# EasyEDA Pro project ProPrj_smartmower_2025-07-31_08-52-16_2025-10-22.epro, board PCB2
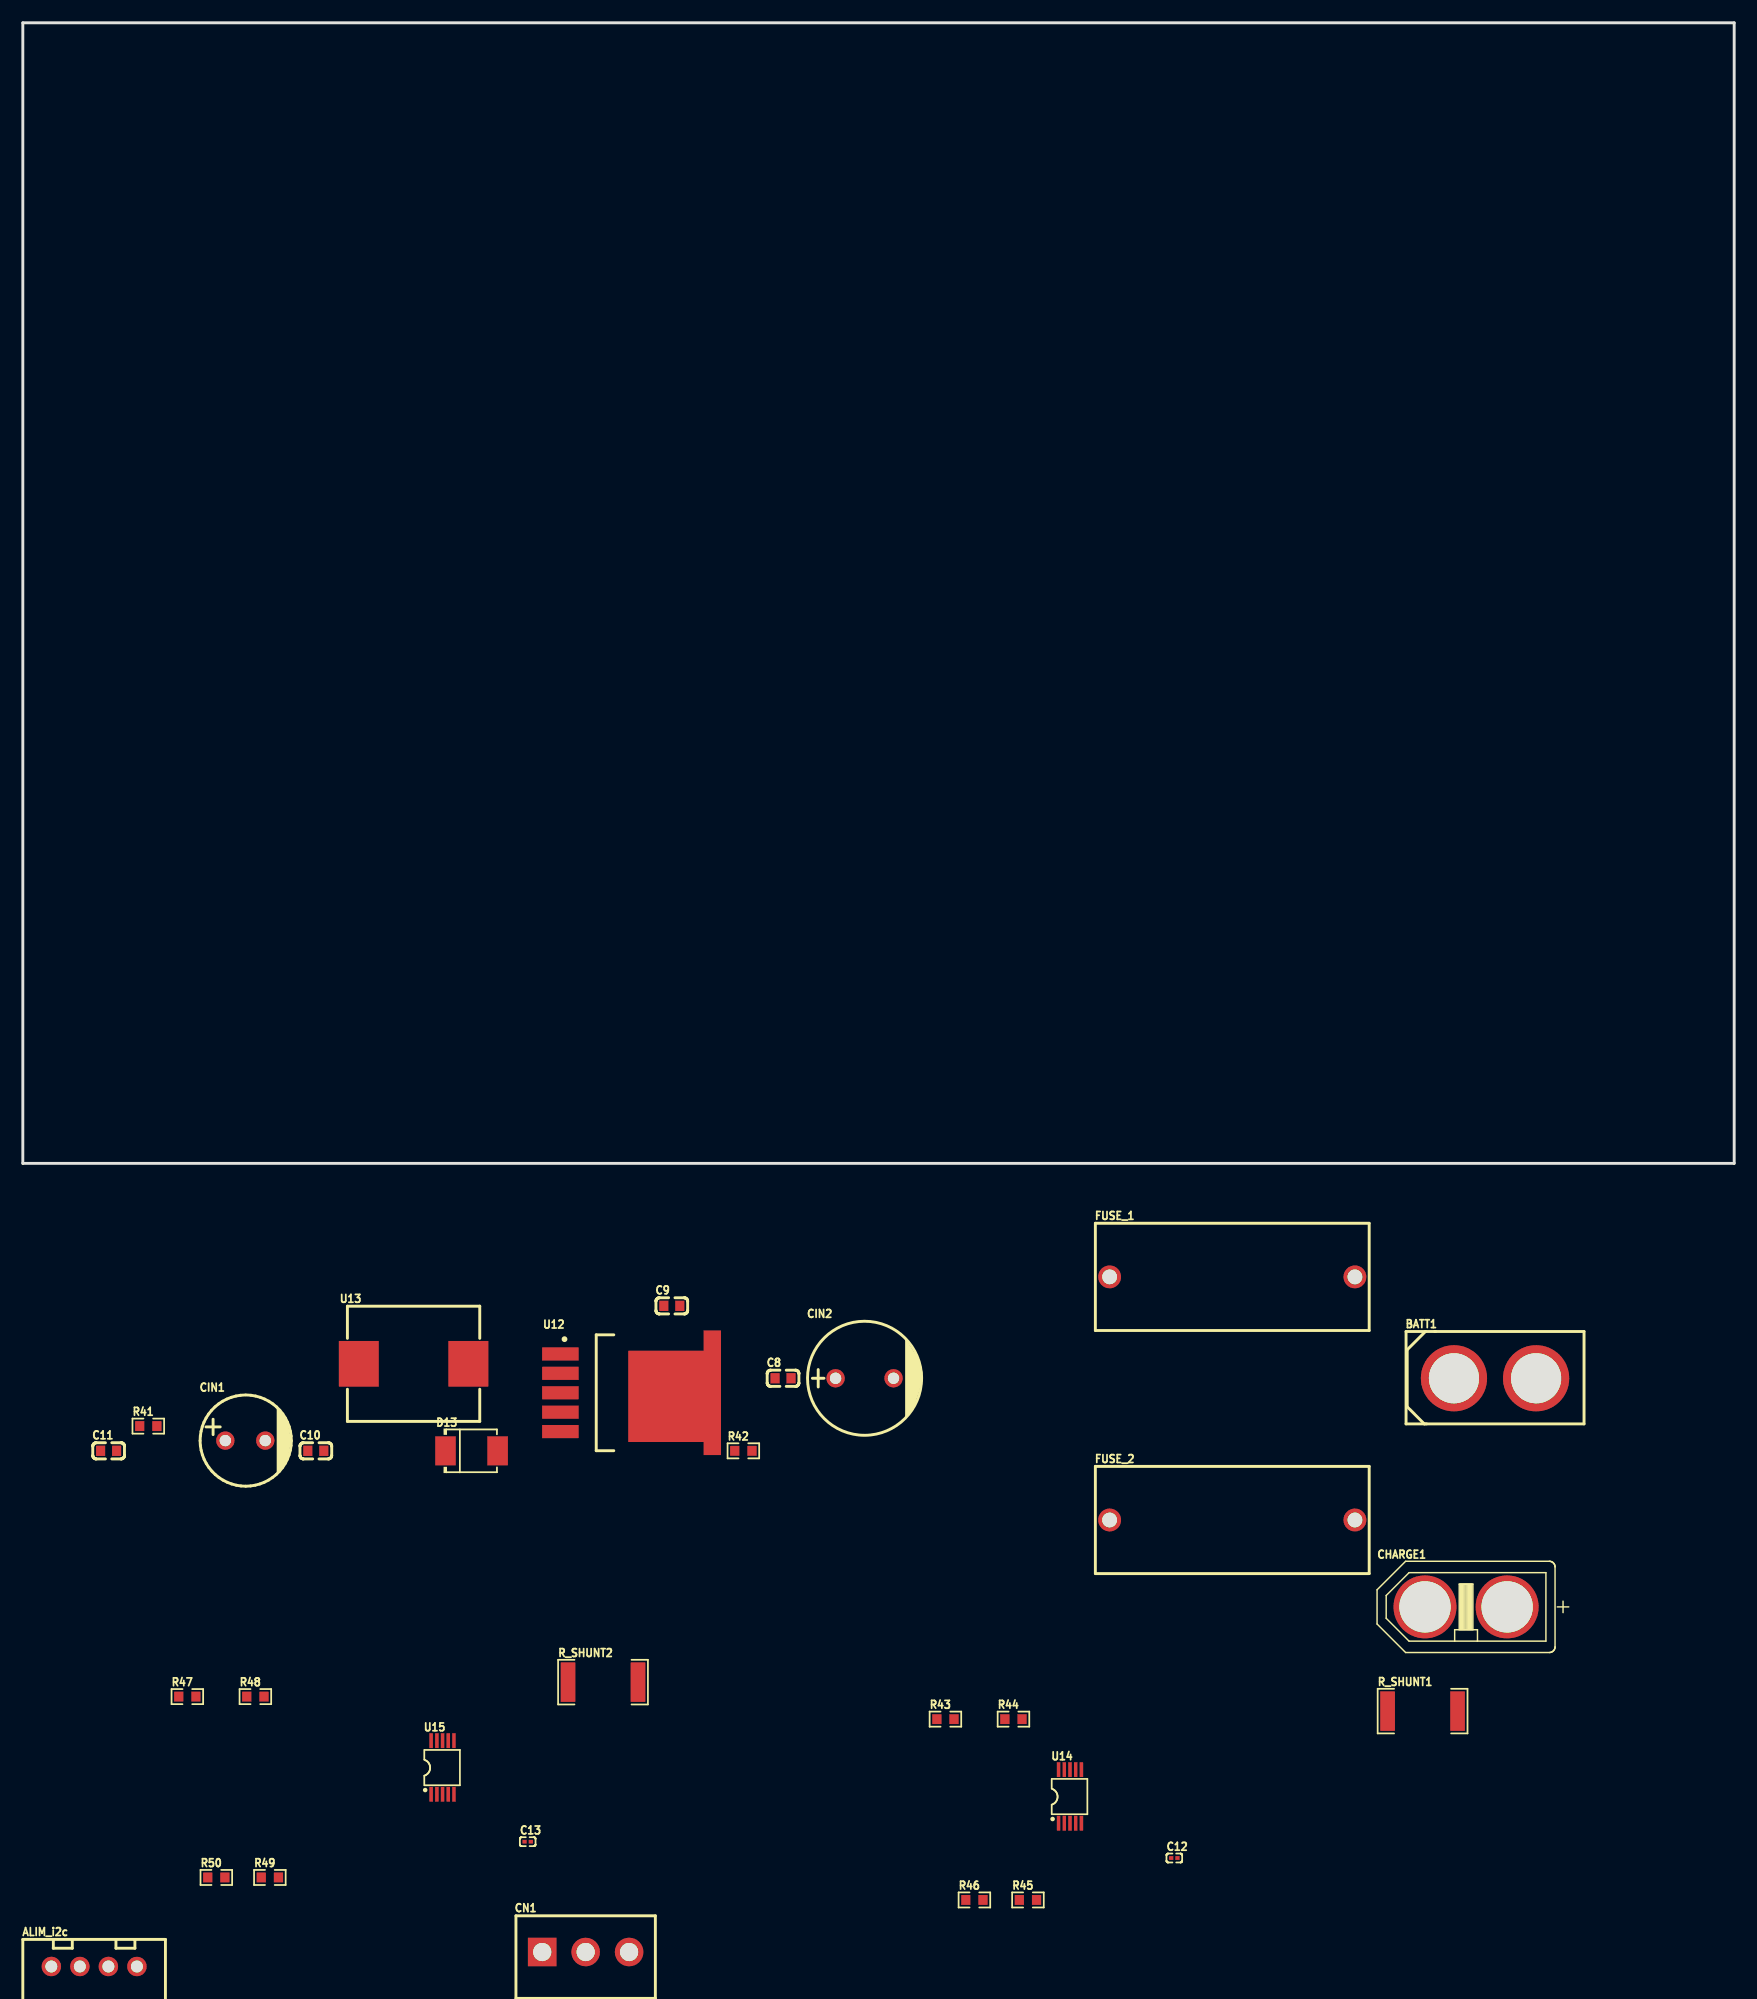
[diagram p2: board, top side]
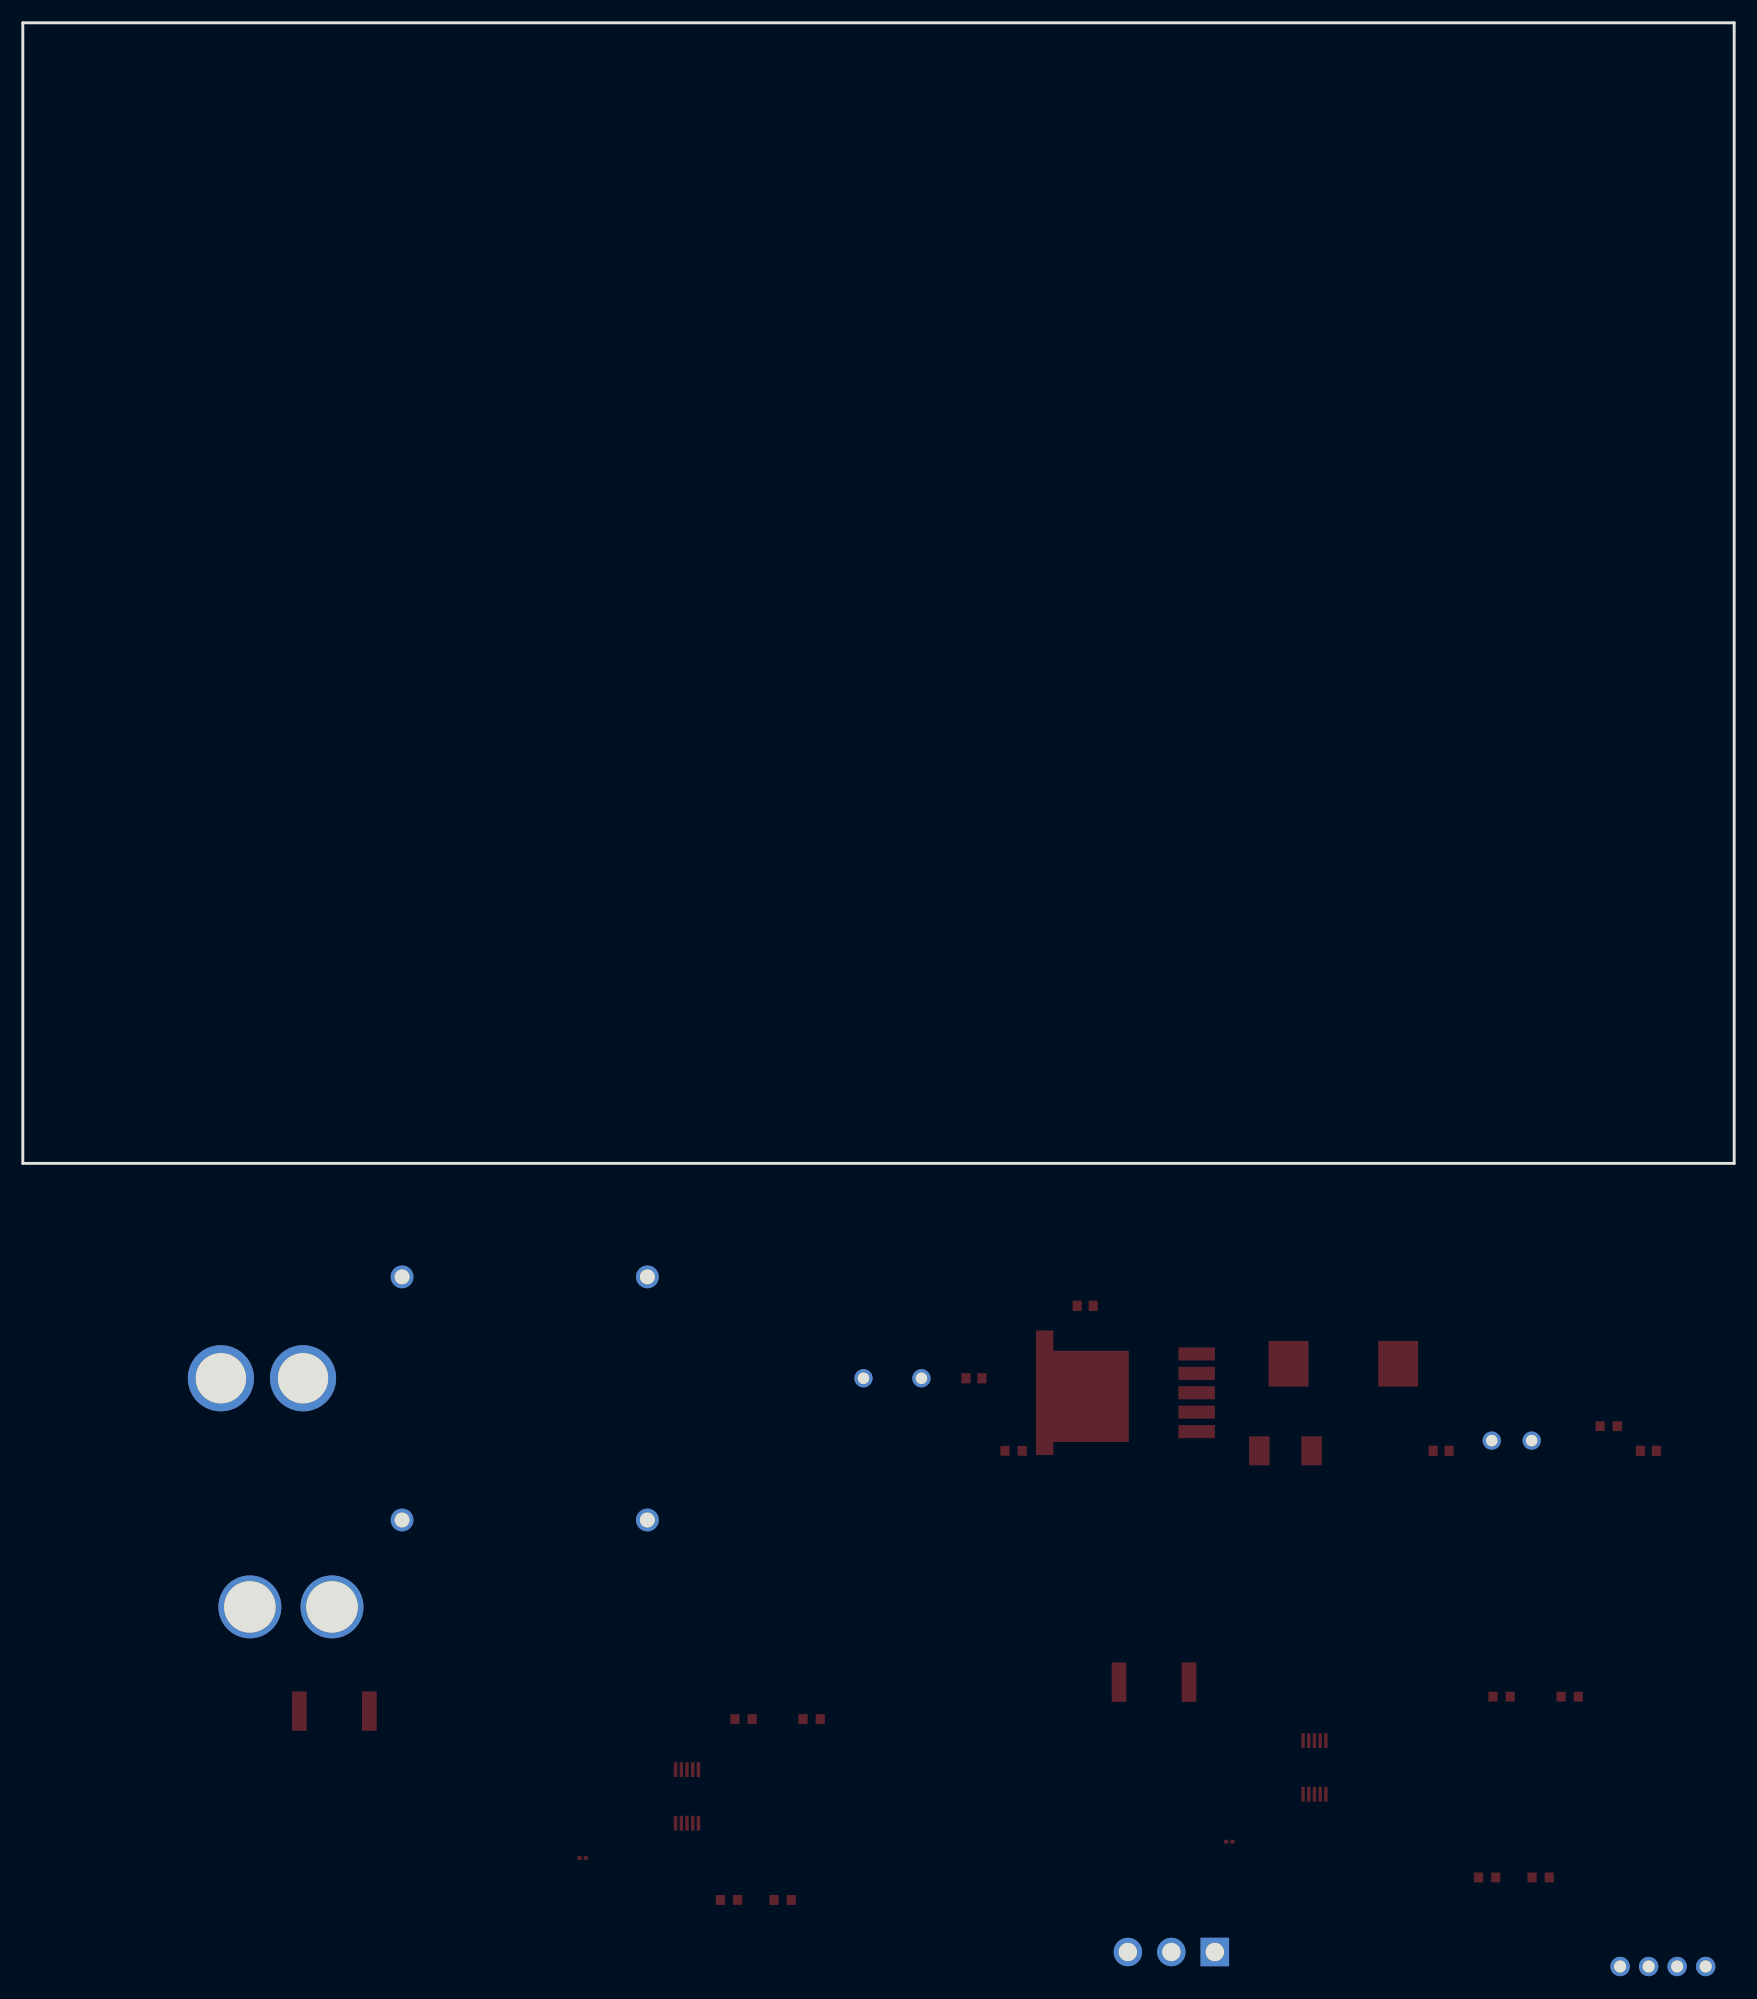
[diagram p3: board, bottom side, seen from below]

Outline 150 x 100 mm; copper layers: Top Layer, Bottom Layer. Coordinates in mm from the lower left corner of the outline.
Outline path: 0,100 150,100 150,0 0,0 0,100
Stack: Top Layer 0.035mm / Dielectric1 1.51mm FR4 er 4.5 / Bottom Layer 0.035mm

## Design rules (mm)
template: JLCPCB Capability(Two Layers Board)
spacing copperThickness1oz (default): track to track 0.102, other pairs 0.152 to 0.3
spacing copperThickness2oz: track to track 0.203, other pairs 0.152 to 0.3
track width copperThickness1oz (default): min 0.127, default 0.254, max 2.54
track width copperThickness2oz: min 0.203, default 0.254, max 2.54
differential pair differentialPair (default): width min 0.127, default 0.254, max 2.54; gap min 0.152, default 0.152
via viaSize (default): diameter min 0.5, default 0.61, max 10; hole min 0.3, default 0.305, max 6.3

## Placement (name value [footprint] x y rotation side)
ALIM_i2c  i2c  [CONN-TH_4P-P2.50-XH2.54-4P]  6.25 -70.42 0 top
BATT1  Batteria  [CONN-TH_XT60]  129.04 -18.84 0 top
C8  100nF  [C0603]  66.63 -18.84 0 top
C9  100nF  [C0603]  56.88 -12.49 0 top
C10  100nF  [C0603]  25.68 -25.21 0 top
C11  33nF  [C0603]  7.52 -25.21 0 top
C12  100nF  [C0201]  100.93 -60.91 0 top
C13  100nF  [C0201]  44.25 -59.47 0 top
CHARGE1  Carica Batteria  [CONN-TH_XT60PB-F]  126.5 -38.89 0 top
CIN1  330uF  [CAP-TH_BD8.0-P3.50-D0.6-FD]  19.5 -24.31 0 top
CIN2  220uF  [CAP-TH_BD10.0-P5.00-D1.0-FD]  73.78 -18.84 0 top
CN1  DB2EVC-3.81-3P-GN  [CONN-TH_3P-P3.81_DB2EVC-3.81-3P]  49.33 -69.15 0 top
D13  SS54  [SMBF_L4.3-W3.6-LS5.3-RD]  39.33 -25.21 0 top
FUSE_1  XF-001  [CONN-TH_XF-001]  106.01 -9.95 0 top
FUSE_2  XF-001  [CONN-TH_XF-001]  106.01 -31.27 0 top
R41  10K  [R0603]  11 -23.04 0 top
R42  3.3K  [R0603]  63.16 -25.21 0 top
R43  10kΩ  [R0603]  80.87 -48.73 0 top
R44  10kΩ  [R0603]  86.83 -48.73 0 top
R45  10kΩ  [R0603]  88.1 -64.58 0 top
R46  10kΩ  [R0603]  83.41 -64.58 0 top
R47  10kΩ  [R0603]  14.42 -46.76 0 top
R48  10kΩ  [R0603]  20.38 -46.76 0 top
R49  10kΩ  [R0603]  21.65 -62.61 0 top
R50  10kΩ  [R0603]  16.96 -62.61 0 top
R_SHUNT1  10mΩ  [R2512]  122.69 -48.03 0 top
R_SHUNT2  10mΩ  [R2512]  50.85 -45.49 0 top
U12  XL4015E1  [TO-263-5_L10.2-W8.9-P1.70-TL]  52.12 -20.11 0 top
U13  47uH  [IND-SMD_L11.6-W10.1]  34.25 -17.57 0 top
U14  INA226AQDGSRQ1  [VSSOP-10_L3.0-W3.0-P0.50-LS4.9-BL]  91.78 -55.51 0 top
U15  INA226AQDGSRQ1  [VSSOP-10_L3.0-W3.0-P0.50-LS4.9-BL]  36.79 -52.97 0 top

## Footprints (pads in the part's own frame, mm; a bottom-side part is the same pattern mirrored in y, then rotated)
C0201
  rect 0.368x0.324 smd: 1(-0.275,0) 2(0.275,0)
C0603
  rect 0.8x0.9 smd: 1(-0.7,0) 2(0.7,0)
CAP-TH_BD8.0-P3.50-D0.6-FD
  round 1.6 hole 1: 1(-1.75,0) 2(1.75,0)
CAP-TH_BD10.0-P5.00-D1.0-FD
  round 1.6 hole 1: 1(-2.54,0) 2(2.54,0)
CONN-TH_3P-P3.81_DB2EVC-3.81-3P
  rect 2.5x2.5 hole 1.6: 1(-3.81,0)
  round 2.5 hole 1.6: 2(0,0) 3(3.81,0)
CONN-TH_4P-P2.50-XH2.54-4P
  round 1.7 hole 1.05: 1(3.75,0) 2(1.25,0) 3(-1.25,0) 4(-3.75,0)
CONN-TH_XF-001
  round 2 hole 1.3: 1(-10.75,0) 2(10.75,0)
CONN-TH_XT60
  round 5.8 hole 4.4: 1(-3.6,0) 2(3.6,0)
CONN-TH_XT60PB-F
  round 5.516 hole 4.505x4.5: +(3.6,0) -(-3.6,0)
IND-SMD_L11.6-W10.1
  rect 3.5x4 smd: 1(-4.8,0) 2(4.8,0)
R0603
  rect 0.806x0.864 smd: 1(-0.753,0) 2(0.753,0)
R2512
  rect 1.282x3.456 smd: 1(-3.067,0) 2(3.067,0)
SMBF_L4.3-W3.6-LS5.3-RD
  rect 1.8x2.54 smd: 1(-2.285,0) 2(2.285,0)
TO-263-5_L10.2-W8.9-P1.70-TL
  rect 3.2x1.15 smd: 1(-5.008,3.404) 2(-5.008,1.702) 3(-5.008,0) 4(-5.008,-1.702) 5(-5.008,-3.404)
  custom 8.128x10.922 smd: 6(5.008,-0.318)
VSSOP-10_L3.0-W3.0-P0.50-LS4.9-BL
  rect 0.3x1.3 smd: 1(-1,-2.35) 2(-0.5,-2.35) 3(0,-2.35) 4(0.5,-2.35) 5(1,-2.35) 6(1,2.35) 7(0.5,2.35) 8(0,2.35) 9(-0.5,2.35) 10(-1,2.35)

## Nets
As in the schematic, except:
5V_ALI: C10.2 C11.2 CIN1.1 CN1.3 R41.2 U13.1
GND_ALI: ALIM_i2c.3 BATT1.1 C8.1 C10.1 C12.2 C13.2 CHARGE1.- CIN1.2 CIN2.2 CN1.2 D13.2 R42.2 R45.2 R46.2 R49.2 R50.2 U12.1 U14.7 U15.7
VOUT_24V_ALI: CN1.1 R_SHUNT2.2 U15.9

Pads without a net: U14 3; U15 3
